# Altium schematic sheet Pic.SchDoc
size A4; Author: Fürst Nicolas; CompanyName: ETML-ES; Address1: Avenue Rencordon 1; Address2: 1004 Lausanne; Address3: Suisse
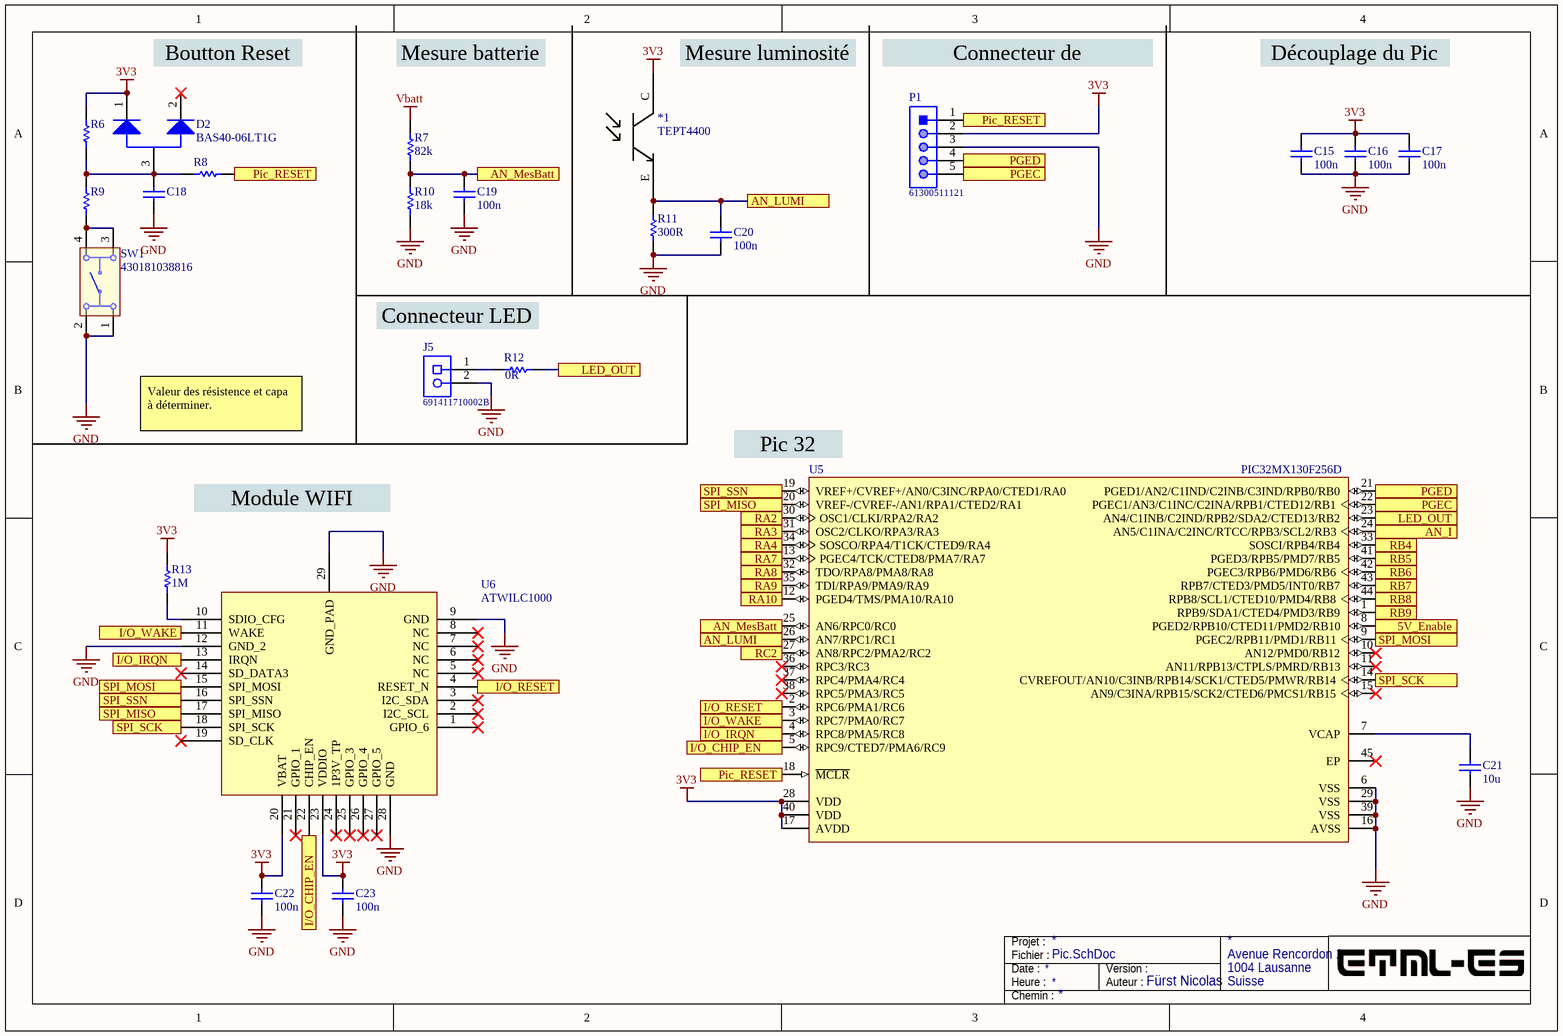
[diagram p0: Pic.SchDoc]

## Parts
*1  TEPT4400  [Type 3mm]
C15  100n  [CAPC0805(2012)155_L]
C16  100n  [CAPC0805(2012)155_L]
C17  100n  [CAPC0805(2012)155_L]
C18  (no value)  [CAPC0805(2012)155_L]
C19  100n  [CAPC0805(2012)155_L]
C20  100n  [CAPC0805(2012)155_L]
C21  10u  [CAPC0805(2012)155_L]
C22  100n  [CAPC0805(2012)155_L]
C23  100n  [CAPC0805(2012)155_L]
D2  BAS40-06LT1G  [ONSC-SOT-23-3-318-08_V]
J5  691411710002B  [691411710002B]
P1  61300511121  [61300511121]
R6  (no value)  [RESC0805(2012)_N]
R7  82k  [RESC0805(2012)_N]
R8  (no value)  [RESC0805(2012)_N]
R9  (no value)  [RESC0805(2012)_N]
R10  18k  [RESC0805(2012)_N]
R11  300R  [RESC0805(2012)_N]
R12  0R  [RESC0805(2012)_N]
R13  1M  [RESC0805(2012)_N]
SW1  430181038816  [430181038816]
U5  PIC32MX130F256D  [QFP80P1200X1200X120-44N]
U6  ATWILC1000  [ATWILC1000]

## Ports
5V_Enable, AN_I, AN_LUMI, AN_MesBatt, I/O_CHIP_EN, I/O_IRQN, I/O_RESET, I/O_WAKE, LED_OUT, PGEC, PGED, Pic_RESET, RA2, RA3, RA4, RA7, RA8, RA9, RA10, RB4, RB5, RB6, RB7, RB8, RB9, RC2, SPI_MISO, SPI_MOSI, SPI_SCK, SPI_SSN

## Nets
3V3: *1.C C15.2 C16.2 C17.2 C22.2 C23.2 D2.1(K1) P1.2 R6.2 R13.2 U5.17(AVDD) U5.28(VDD) U5.40(VDD) U6.20(VBAT) U6.23(VDDIO)
GND: C15.1 C16.1 C17.1 C18.1 C19.1 C20.1 C21.1 C22.1 C23.1 J5.2 P1.3 R10.1 R11.1 SW1.1 SW1.2 U5.6(VSS) U5.16(AVSS) U5.29(VSS) U5.39(VSS) U6.9(GND) U6.12(GND_2) U6.28(GND) U6.29(GND_PAD)
Vbatt: R7.2
5V_Enable: U5.8(PGED2/RPB10/CTED11/PMD2/RB10) ; port 5V_Enable
AN_I: U5.24(AN5/C1INA/C2INC/RTCC/RPB3/SCL2/RB3) ; port AN_I
AN_LUMI: *1.E C20.2 R11.2 U5.26(AN7/RPC1/RC1) ; port AN_LUMI
AN_MesBatt: C19.2 R7.1 R10.2 U5.25(AN6/RPC0/RC0) ; port AN_MesBatt
I/O_CHIP_EN: U5.5(RPC9/CTED7/PMA6/RC9) U6.22(CHIP_EN) ; port I/O_CHIP_EN
I/O_IRQN: U5.4(RPC8/PMA5/RC8) U6.13(IRQN) ; port I/O_IRQN
I/O_RESET: U5.2(RPC6/PMA1/RC6) U6.4(RESET_N) ; port I/O_RESET
I/O_WAKE: U5.3(RPC7/PMA0/RC7) U6.11(WAKE) ; port I/O_WAKE
LED_OUT: R12.1 U5.23(AN4/C1INB/C2IND/RPB2/SDA2/CTED13/RB2) ; port LED_OUT
PGEC: P1.5 U5.22(PGEC1/AN3/C1INC/C2INA/RPB1/CTED12/RB1) ; port PGEC
PGED: P1.4 U5.21(PGED1/AN2/C1IND/C2INB/C3IND/RPB0/RB0) ; port PGED
Pic_RESET: P1.1 R8.1 U5.18(~{MCLR}) ; port Pic_RESET
RA2: U5.30(OSC1/CLKI/RPA2/RA2) ; port RA2
RA3: U5.31(OSC2/CLKO/RPA3/RA3) ; port RA3
RA4: U5.34(SOSCO/RPA4/T1CK/CTED9/RA4) ; port RA4
RA7: U5.13(PGEC4/TCK/CTED8/PMA7/RA7) ; port RA7
RA8: U5.32(TDO/RPA8/PMA8/RA8) ; port RA8
RA9: U5.35(TDI/RPA9/PMA9/RA9) ; port RA9
RA10: U5.12(PGED4/TMS/PMA10/RA10) ; port RA10
RB4: U5.33(SOSCI/RPB4/RB4) ; port RB4
RB5: U5.41(PGED3/RPB5/PMD7/RB5) ; port RB5
RB6: U5.42(PGEC3/RPB6/PMD6/RB6) ; port RB6
RB7: U5.43(RPB7/CTED3/PMD5/INT0/RB7) ; port RB7
RB8: U5.44(RPB8/SCL1/CTED10/PMD4/RB8) ; port RB8
RB9: U5.1(RPB9/SDA1/CTED4/PMD3/RB9) ; port RB9
RC2: U5.27(AN8/RPC2/PMA2/RC2) ; port RC2
SPI_MISO: U5.20(VREF-/CVREF-/AN1/RPA1/CTED2/RA1) U6.17(SPI_MISO) ; port SPI_MISO
SPI_MOSI: U5.9(PGEC2/RPB11/PMD1/RB11) U6.15(SPI_MOSI) ; port SPI_MOSI
SPI_SCK: U5.14(CVREFOUT/AN10/C3INB/RPB14/SCK1/CTED5/PMWR/RB14) U6.18(SPI_SCK) ; port SPI_SCK
SPI_SSN: U5.19(VREF+/CVREF+/AN0/C3INC/RPA0/CTED1/RA0) U6.16(SPI_SSN) ; port SPI_SSN
NetC18_2: C18.2 D2.3(A) R6.1 R8.2 R9.2
NetC21_2: C21.2 U5.7(VCAP)
NetJ5_1: J5.1 R12.2
NetR9_1: R9.1 SW1.3 SW1.4
NetR13_1: R13.1 U6.10(SDIO_CFG)

Not connected (* = marked no-connect by the designer): D2 2(K2)*; U5 10(AN12/PMD0/RB12)* 11(AN11/RPB13/CTPLS/PMRD/RB13)* 15(AN9/C3INA/RPB15/SCK2/CTED6/PMCS1/RB15)* 36(RPC3/RC3)* 37(RPC4/PMA4/RC4)* 38(RPC5/PMA3/RC5)* 45(EP)*; U6 1(GPIO_6)* 2(I2C_SCL)* 3(I2C_SDA)* 5(NC)* 6(NC)* 7(NC)* 8(NC)* 14(SD_DATA3)* 19(SD_CLK)* 21(GPIO_1)* 24(1P3V_TP)* 25(GPIO_3)* 26(GPIO_4)* 27(GPIO_5)*

## Notes on the sheet
- Boutton Reset
- Mesure batterie
- Mesure luminosité
- Connecteur de programmation
- Découplage du Pic
- Connecteur LED
- Valeur des résistence et capa à déterminer.
- Module WIFI
- (near U5) Pic 32
- Fichier :
- Date :
- Heure :
- Projet :
- Auteur :
- Version :
- Chemin :

## Library data of the parts
C15-C23 = Capa: Case-EIA: 0805; Rated Voltage: 10 V; Value: 4.7uF; Tolerance: Â±10%; Case-Metric: 2012; Max Thickness: 1.55 mm; Technology: SMT
D2 = CMP-1055-00547-1: Common Anode Schottky Barrier Diodes, 3-Pin SOT-23, Pb-Free, Tape and Reel; Manufacturer: On Semiconductor; ComponentLink3URL: http://www.onsemi.cn/pub_link/Collateral/318-08.PDF; Packing: Tape and Reel; PackageReference: SOT-23-3-318-08; ComponentLink1Description: Manufacturer URL; PackageDescription: 3-Pin Small Outline Transistor, Body 2.92 x 1.3 mm, Pitch 0.95 mm; ComponentLink1URL: http://www.onsemi.com/; Configuration: Common Anode; Mounting Technology: Surface Mount; RoHS: TRUE; PartNumber: BAS40-06LT1G; ComponentLink3Description: Package Specification; ComponentLink2Description: Datasheet; PackageVersion: Rev. AP, 11/2009; ComponentLink2URL: http://www.onsemi.cn/pub_link/Collateral/BAS40-06LT1-D.PDF; DatasheetVersion: Rev. 8
J5 = CMP-1502-03026-1: Serie 411 B - 5.00mm Screwless Horizontal Entry-2.0mm2 Wires WR-TBL, 2 pin; Manufacturer: Wurth Elektronik; Pin Number: 2; Publisher: WurthElektronik; Pitch: 5.00mm; Package Reference: 691411710002B; Datasheet URL: http://katalog.we-online.de/em/datasheet/6914117100xxB.pdf; Mounting Technology: THT; Manufacturer URL: http://www.we-online.de; Packaging: Box; Part Number: 691411710002B; Operating Temperature: -40to105degC
P1 = CMP-1502-01068-1: THT Vertical Pin Header WR-PHD, Pitch 2.54 mm, Single Row, 5 pins; Manufacturer: Wurth Elektronik; Pin Number: 5; Contact Resistance: 20mOhm; Working Voltage: 250VAC; Pitch: 2.54mm; Withstanding Voltage: 500VAC; Rated Current: 3A; Gender: Male; Datasheet URL: https://katalog.we-online.de/em/datasheet/6130xx11121.pdf; Orientation: Vertical; Mounting Technology: THT; Row Number: Single; Package Reference: 61300511121; Publisher: WurthElektronik; Part Number: 61300511121; Packaging: Bag; Manufacturer URL: http://www.we-online.de; Operating Temperature: -40to105degC
R6-R13 = Resistor: Value: 1000000.00 Ohm; Case-Metric: 2012; Case-EIA: 0805; Power: 0.125 W; Tolerance: 1 %; Technology: SMT
SW1 = CMP-1454-00001-1: WS-TASV SMD Tact Switch 4.5X4.5 mm; Manufacturer: Wuerth Elektronik; NoPins: 04; PartNumber: 430181038816; ComponentLink1Description: Manufacturer URL; ComponentLink2URL: http://katalog.we-online.de/em/datasheet/430181038816.pdf; ComponentLink1URL: http://www.we-online.com; PackageReference: 430181038816; ComponentLink2Description: Datasheet
U5 = PIC32MX130F256D: PartNumber: PIC32MX130F064D-I/TL; Manufacturer: Microchip; Mounting Technology: Surface Mount; ComponentLink4Description: Product URL; DatasheetVersion: Rev. E; ComponentLink4URL: http://www.microchip.com/PIC32MX130F064D; PackageVersion: C04-157C; ComponentLink3URL: http://www.microchip.com/stellent/groups/techpub_sg/documents/packagingspec/en012702.pdf; PackageDescription: 44-Lead Terminal Very Thin Leadless Array Package, 6 x 6 mm Body, 0.5 mm Pitch; ComponentLink2URL: http://ww1.microchip.com/downloads/en/DeviceDoc/61168E.pdf; ComponentLink1URL: http://www.microchip.com; PackageReference: VTLA-TL44; ComponentLink2Description: Datasheet; ComponentLink3Description: Package Specification; ComponentLink1Description: Manufacturer URL